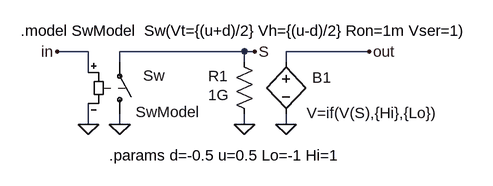
[diagram p0: schematic HysterB.asc]
HysterB.asc, the LTspice schematic file:
Version 4
SHEET 1 1288 680
WIRE 240 96 192 96
WIRE 480 96 288 96
WIRE 496 96 480 96
WIRE 672 96 544 96
WIRE 288 112 288 96
WIRE 480 112 480 96
WIRE 544 112 544 96
WIRE 240 128 240 96
WIRE 240 208 240 176
WIRE 288 208 288 192
WIRE 480 208 480 192
WIRE 544 208 544 192
FLAG 672 96 out
FLAG 192 96 in
FLAG 240 208 0
FLAG 480 208 0
FLAG 288 208 0
FLAG 544 208 0
FLAG 496 96 S
SYMBOL sw 288 208 M180
WINDOW 0 36 75 Left 0
WINDOW 3 25 19 Left 0
SYMATTR InstName Sw
SYMATTR Value SwModel
SYMBOL res 464 96 R0
WINDOW 0 -40 38 Left 0
WINDOW 3 -40 67 Left 0
SYMATTR InstName R1
SYMATTR Value 1G
SYMBOL bv 544 96 R0
WINDOW 0 40 40 Left 0
WINDOW 3 32 95 Left 0
SYMATTR InstName B1
SYMATTR Value V=if(V(S),{Hi},{Lo})
TEXT 136 64 Left 0 !.model SwModel  Sw(Vt={(u+d)/2} Vh={(u-d)/2} Ron=1m Vser=1)
TEXT 272 256 Left 0 !.params d=-0.5 u=0.5 Lo=-1 Hi=1

The netlist it stands for:
* HysterB.asc
Sw 0 S in 0 SwModel
R1 S 0 1G
B1 out 0 V=if(V(S),{Hi},{Lo})
.model SwModel  Sw(Vt={(u+d)/2} Vh={(u-d)/2} Ron=1m Vser=1)
.params d=-0.5 u=0.5 Lo=-1 Hi=1
.backanno
.end